# Altium schematic sheet TPS65218.SchDoc
size A2
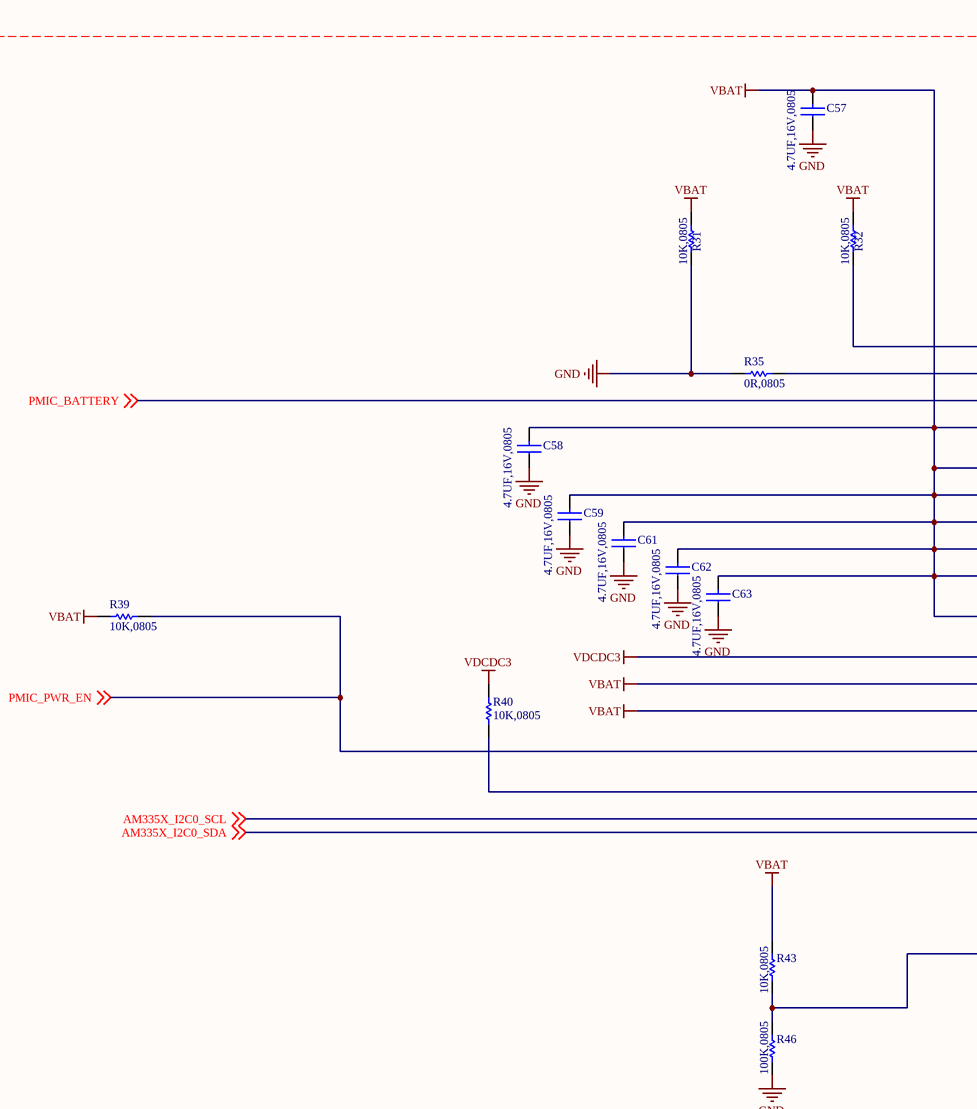
[diagram p0: TPS65218.SchDoc, top left]
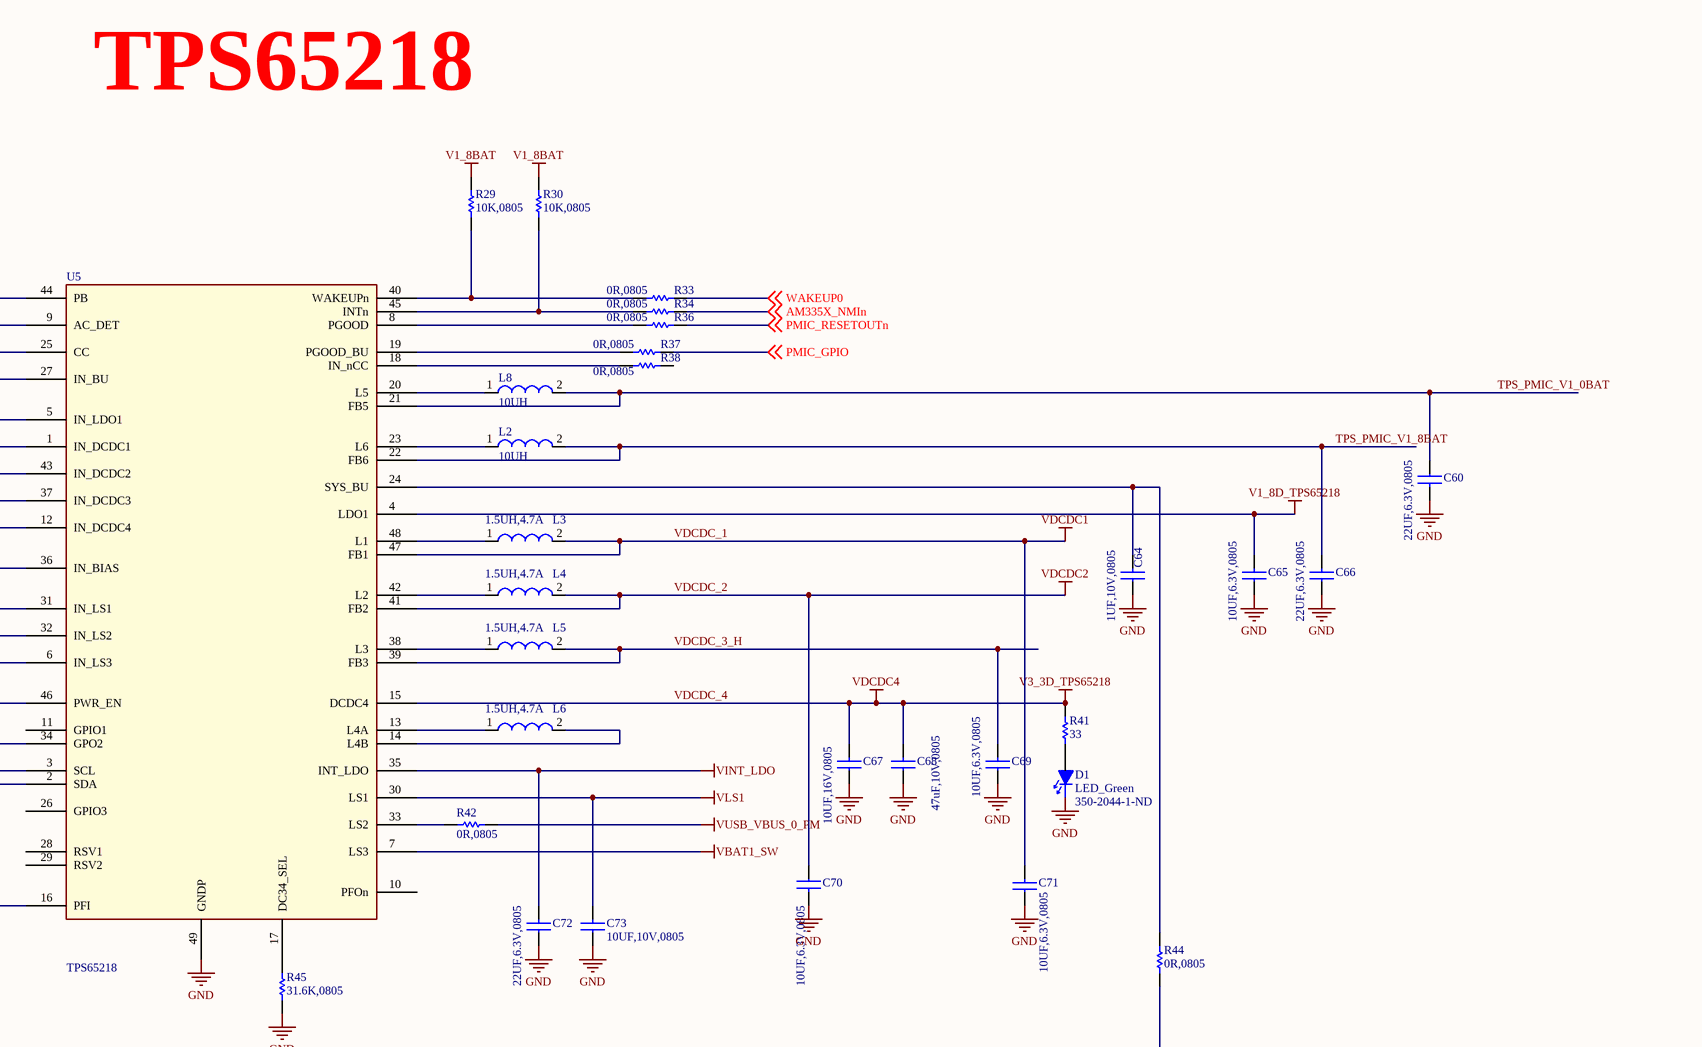
[diagram p1: TPS65218.SchDoc, top right]
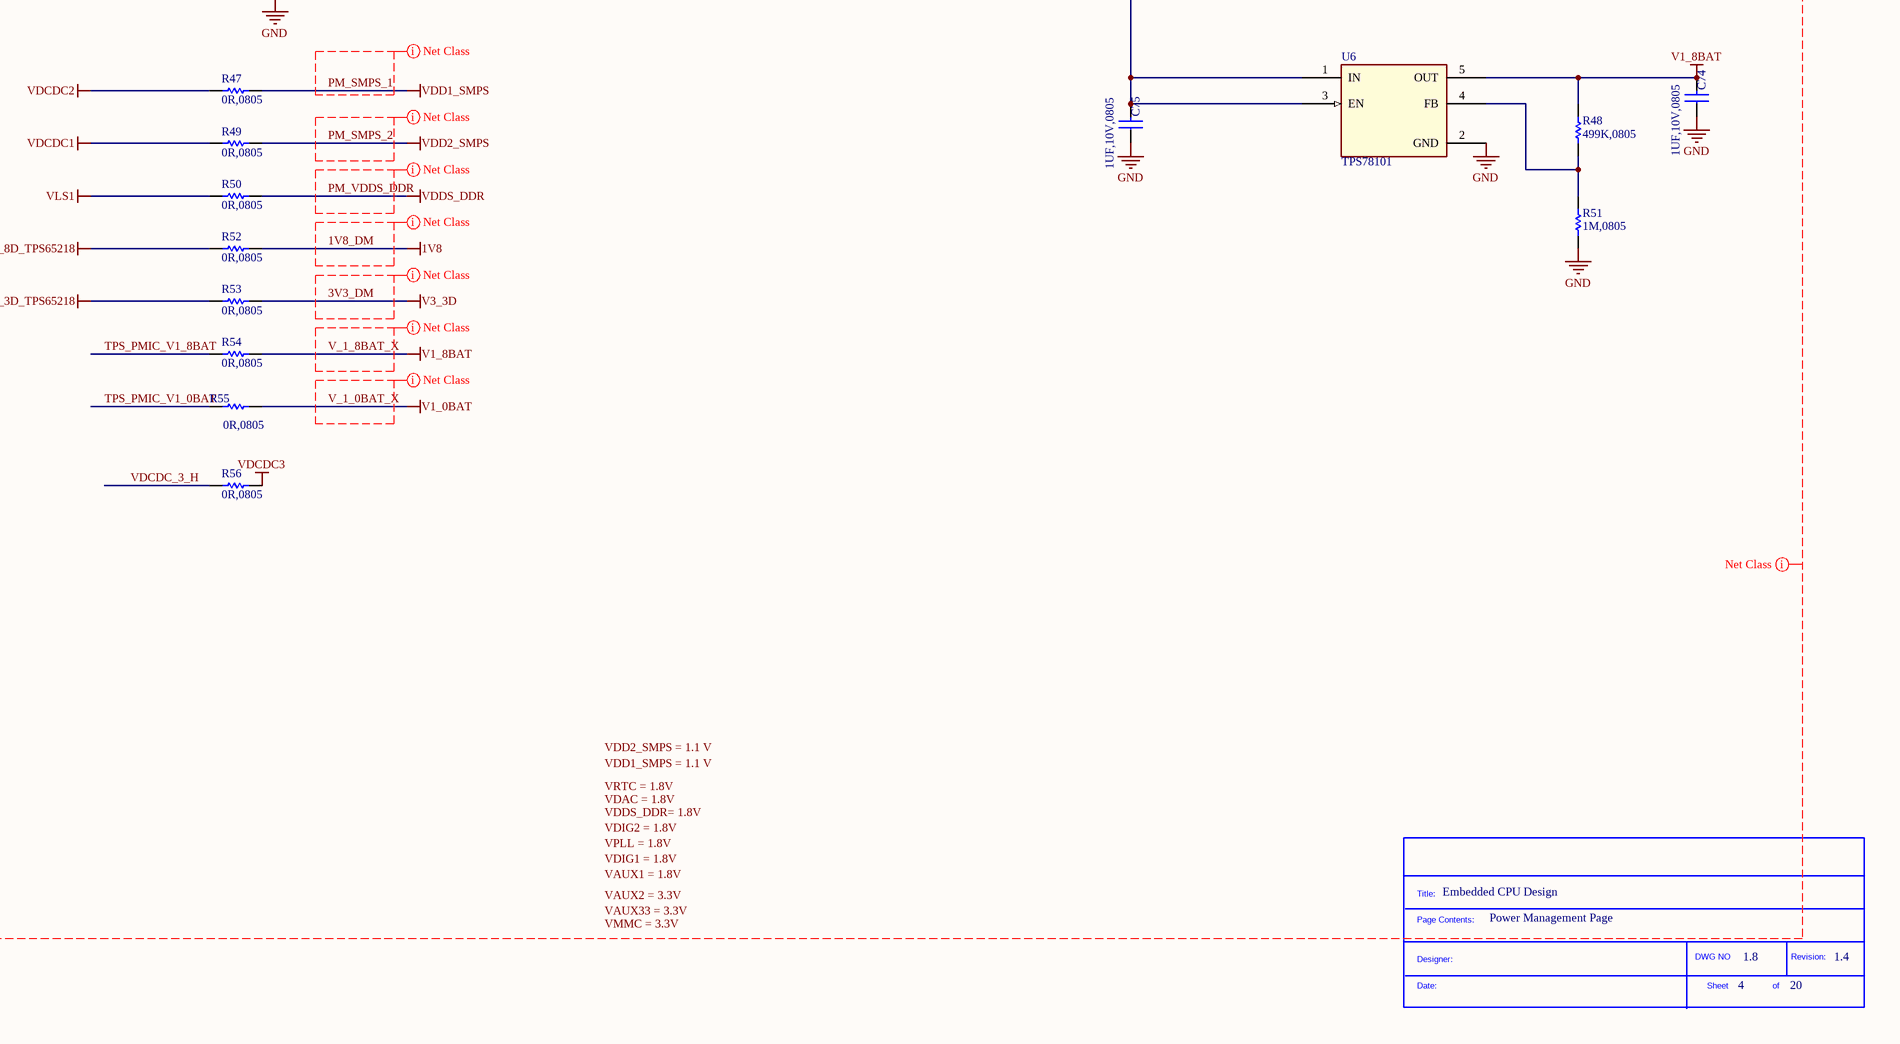
[diagram p2: TPS65218.SchDoc, bottom right]

## Parts
*?  SDTitleBlock  (value not drawn)  (graphical)
C57  4.7UF,16V,0805  [0805]
C58  4.7UF,16V,0805  [0805]
C59  4.7UF,16V,0805  [0805]
C60  22UF,6.3V,0805  [0805]
C61  4.7UF,16V,0805  [0805]
C62  4.7UF,16V,0805  [0805]
C63  4.7UF,16V,0805  [0805]
C64  1UF,10V,0805  [0805]
C65  10UF,6.3V,0805  [0805]
C66  22UF,6.3V,0805  [0805]
C67  10UF,16V,0805  [0805]
C68  47uF,10V,0805  [0805]
C69  10UF,6.3V,0805  [0805]
C70  10UF,6.3V,0805  [0805]
C71  10UF,6.3V,0805  [0805]
C72  22UF,6.3V,0805  [0805]
C73  10UF,10V,0805  [0805]
C74  1UF,10V,0805  [0805]
C75  1UF,10V,0805  [0805]
D1  LED_Green  Supplier Part Number 1: 350-2044-1-ND  [LED_0805]
L2  10UH  [0805]
L3  1.5UH,4.7A  [INDUCTR_2]
L4  1.5UH,4.7A  [INDUCTR_2]
L5  1.5UH,4.7A  [INDUCTR_2]
L6  1.5UH,4.7A  [INDUCTR_2]
L8  10UH  [0805]
R29  10K,0805  [0402]
R30  10K,0805  [0402]
R31  10K,0805  [0402]
R32  10K,0805  [0402]
R33  0R,0805  [0402]
R34  0R,0805  [0402]
R35  0R,0805  [0402]
R36  0R,0805  [0402]
R37  0R,0805  [0402]
R38  0R,0805  [0402]
R39  10K,0805  [0402]
R40  10K,0805  [0402]
R41  33  [0402]
R42  0R,0805  [0402]
R43  10K,0805  [0402]
R44  0R,0805  [0402]
R45  31.6K,0805  [0603]
R46  100K,0805  [0402]
R47  0R,0805  [0402]
R48  499K,0805  [0402]
R49  0R,0805  [0402]
R50  0R,0805  [0402]
R51  1M,0805  [0402]
R52  0R,0805  [0402]
R53  0R,0805  [0402]
R54  0R,0805  [0402]
R55  0R,0805  [0402]
R56  0R,0805  [0402]
U5  TPS65218  [HTQFP_48pin]
U6  TPS78101  [smdsc70-5 DOUBLE]

## Nets
1V8_DM: R52.2  [also labelled 1V8]
3V3_DM: R53.1  [also labelled V3_3D]
GND: C57.1 C58.1 C59.1 C60.2 C61.1 C62.1 C63.1 C64.1 C65.1 C66.1 C67.1 C68.1 C69.1 C70.2 C71.1 C72.1 C73.1 C74.1 C75.1 D1.1(Cathode) R31.1 R35.1 R45.1 R46.1 R51.1 U5.49(GNDP) U6.2(GND)
PM_SMPS_1: R47.2  [also labelled VDD1_SMPS]
PM_SMPS_2: R49.2  [also labelled VDD2_SMPS]
PM_VDDS_DDR: R50.2  [also labelled VDDS_DDR]
V1_8D_TPS65218: C65.2 R52.1 U5.4(LDO1)
V_1_0BAT_X: R55.2  [also labelled V1_0BAT]
V_1_8BAT_X: C74.2 R29.2 R30.2 R48.2 R54.2 U6.5(OUT)  [also labelled V1_8BAT]
VBAT: C57.2 C58.2 C59.2 C61.2 C62.2 C63.2 R31.2 R32.2 R39.1 R43.2 U5.1(IN_DCDC1) U5.5(IN_LDO1) U5.6(IN_LS3) U5.12(IN_DCDC4) U5.27(IN_BU) U5.32(IN_LS2) U5.36(IN_BIAS) U5.37(IN_DCDC3) U5.43(IN_DCDC2)
VBAT1_SW: U5.7(LS3)
VDCDC3: R40.2 R56.2 U5.31(IN_LS1)
VDCDC_1: C71.2 L3.2 R49.1 U5.47(FB1)  [also labelled VDCDC1]
VDCDC_2: C70.1 L4.2 R47.1 U5.41(FB2)  [also labelled VDCDC2]
VDCDC_4: C67.2 C68.2 R41.2 R53.2 U5.15(DCDC4)  [also labelled V3_3D_TPS65218, VDCDC4]
VINT_LDO: C72.2 U5.35(INT_LDO)
VLS1: C73.2 R50.1 U5.30(LS1)
VUSB_VBUS_0_PM: R42.2
AM335X_I2C0_SCL: U5.3(SCL) ; off-sheet AM335X_I2C0_SCL
AM335X_I2C0_SDA: U5.2(SDA) ; off-sheet AM335X_I2C0_SDA
AM335X_NMIn: R34.2 ; off-sheet AM335X_NMIn
PMIC_BATTERY: U5.25(CC) ; off-sheet PMIC_BATTERY
PMIC_GPIO: R37.2 ; off-sheet PMIC_GPIO
PMIC_PWR_EN: R39.2 U5.46(PWR_EN) ; off-sheet PMIC_PWR_EN
PMIC_RESETOUTn: R36.2 ; off-sheet PMIC_RESETOUTn
TPS_PMIC_V1_0BAT: C60.1 L8.2 R55.1 U5.21(FB5)
TPS_PMIC_V1_8BAT: C66.2 L2.2 R54.1 U5.22(FB6)
VDCDC_3_H: C69.2 L5.2 R56.1 U5.39(FB3)
WAKEUP0: R33.2 ; off-sheet WAKEUP0
NetC64_2: C64.2 R44.2 U5.24(SYS_BU)
NetC75_2: C75.2 R44.1 U6.1(IN) U6.3(EN)
NetD1_2: D1.2(Anode) R41.1
NetL2_1: L2.1 U5.23(L6)
NetL3_1: L3.1 U5.48(L1)
NetL4_1: L4.1 U5.42(L2)
NetL5_1: L5.1 U5.38(L3)
NetL6_1: L6.1 U5.13(L4A)
NetL6_2: L6.2 U5.14(L4B)
NetL8_1: L8.1 U5.20(L5)
NetR29_1: R29.1 R33.1 U5.40(WAKEUPn)
NetR30_1: R30.1 R34.1 U5.45(INTn)
NetR32_1: R32.1 U5.44(PB)
NetR35_2: R35.2 U5.9(AC_DET)
NetR36_1: R36.1 U5.8(PGOOD)
NetR37_1: R37.1 U5.19(PGOOD_BU)
NetR38_1: R38.1 U5.18(IN_nCC)
NetR40_1: R40.1 U5.34(GPO2)
NetR42_1: R42.1 U5.33(LS2)
NetR43_1: R43.1 R46.2 U5.16(PFI)
NetR45_2: R45.2 U5.17(DC34_SEL)
NetR48_1: R48.1 R51.2 U6.4(FB)

Not connected (* = marked no-connect by the designer): R38 2; U5 10(PFOn) 11(GPIO1) 26(GPIO3) 28(RSV1) 29(RSV2)

## Layout directives
net class PM_SMPS_2: PM_SMPS_2
net class PM_SMPS_1: PM_SMPS_1
net class PM_VDDS_DDR: PM_VDDS_DDR
net class PM_VDIG2: 1V8_DM
net class PM_3V3DM: 3V3_DM
net class TPS65218: 1V8, 1V8_DM, 3V3_DM, AM335X_I2C0_SCL, AM335X_I2C0_SDA, AM335X_NMIn, GND, PM_SMPS_1, PM_SMPS_2, PM_VDDS_DDR, PMIC_BATTERY, PMIC_GPIO, PMIC_PWR_EN, PMIC_RESETOUTn, TPS_PMIC_V1_0BAT, TPS_PMIC_V1_8BAT, V1_0BAT, V1_8BAT, V1_8D_TPS65218, V3_3D, V3_3D_TPS65218, V_1_0BAT_X, V_1_8BAT_X, VAUX1 = 1.8V, VAUX2 = 3.3V, VAUX33 = 3.3V, VBAT, VBAT1_SW, VDAC = 1.8V, VDCDC1, VDCDC2, VDCDC3, VDCDC4, VDCDC_1, VDCDC_2, VDCDC_3_H, VDCDC_4, VDD1_SMPS, VDD1_SMPS = 1.1 V, VDD2_SMPS, VDD2_SMPS = 1.1 V, VDDS_DDR, VDDS_DDR= 1.8V, VDIG1 = 1.8V, VDIG2 = 1.8V, VINT_LDO, VLS1, VMMC = 3.3V, VPLL = 1.8V, VRTC = 1.8V, VUSB_VBUS_0_PM, WAKEUP0
net class PM_V_1_8BAT_X: V_1_8BAT_X
net class PM_V_1_0BAT_X: V_1_0BAT_X

## Notes on the sheet
- TPS65218
- Embedded CPU Design
- Power Management Page
- 1.8
- 1.4
- 4
- 20
- Labels drawn without touching a wire or pin: VAUX1 = 1.8V, VAUX2 = 3.3V, VAUX33 = 3.3V, VDAC = 1.8V, VDD1_SMPS = 1.1 V, VDD2_SMPS = 1.1 V, VDDS_DDR= 1.8V, VDIG1 = 1.8V, VDIG2 = 1.8V, VMMC = 3.3V, VPLL = 1.8V, VRTC = 1.8V
- (in symbol SDTitleBlock) Title:; Page Contents:; Designer:; DWG NO; Revision:; Date:; Sheet; of

## Library data of the parts
C57-C59 C61-C63 = 4.7UF,16V,0805: AVX - 0805YC475KAT2A - CAP, MLCC, X7R, 4.7UF, 16V, 0805; Capacitance: 4.7; Capacitance Tolerance: ± 10%; Dielectric Characteristic: X7; Voltage Rating: 16; Ceramic Capacitor Case: 0805 [2012 Metric]; SVHC: No SVHC (16-Jun-2014); Capacitor Terminals: SMD; Tolerance: ±10%; Temperature Coefficient: X5R; Manufacturer: AVX; Manufacturer Part Number: 0805YC475KAT2A; RoHS: YES; Product Range: -; Operating Temperature Min: -55; Operating Temperature Max: 125; Packaging: Cut Tape; MSL: MSL 1 - Unlimited; Capacitance Tolerance ±: ± 10%; Capacitor Case Style: 0805 [2012 Metric]; Operating Temperature Range: -55°C to +125; Series: MLCC<!--FANDB--><div class="features-and-benefits-container"></div>; ComponentLink1URL: http://www.farnell.com/datasheets/1679506.pdf; ComponentLink1Description: http://www.farnell.com/datasheets/1679506.pdf; ComponentLink2URL: http://www.farnell.com/cad/1614401.zip; ComponentLink2Description: http://www.farnell.com/cad/1614401.zip; Supplier 1: Digi-Key; Category: Capacitors; Stock 1: 362746; Pricing 1: 1=0.21, 10=0.146, 25=0.1064, 100=0.0743, 500=0.0531, 1000=0.04514 (USD); Voltage - Rated: 16V; Mounting Type: Surface Mount, MLCC; Operating Temperature: -55°C ~ 85°C; Applications: General Purpose; Ratings: -; Package / Case: 0805 (2012 Metric); Size / Dimension: 0.079" L x 0.049" W (2.00mm x 1.25mm); Height - Seated (Max): -; Thickness (Max): 0.053" (1.35mm); Lead Spacing: -; Features: -; Lead Style: -; ComponentLink3URL: http://www.samsungsem.com/kr/front/downloadcms.do?path=/kr/support/product-search/mlcc/__icsFiles/afieldfile/2014/11/05&fileName=S_CL21A475KOFNNNE.pdf; ComponentLink3Description: http://www.samsungsem.com/kr/front/downloadcms.do?path=/kr/support/product-search/mlcc/__icsFiles/afieldfile/2014/11/05&fileName=S_CL21A475KOFNNNE.pdf; Supplier Part Number 1: 1276-1065-1-ND
C60 C66 C72 = 22UF,6.3V,0805: CAP CER 22UF 6.3V 10% X5R 0805; Manufacturer: Samsung Electro-Mechanics America, Inc; Manufacturer Part Number: CL21A226KQQNNNE; Capacitance: 22µF; Supplier 1: Digi-Key; RoHS: RoHS Compliant; Category: Capacitors; Stock 1: 218754; Pricing 1: 1=0.27, 10=0.182, 25=0.132, 50=0.11, 100=0.0924, 250=0.0748, 500=0.066, 1000=0.0561 (USD); Packaging: Digi-Reel®; Tolerance: ±10%; Voltage - Rated: 6.3V; Temperature Coefficient: X5R; Mounting Type: Surface Mount, MLCC; Operating Temperature: -55°C ~ 85°C; Applications: General Purpose; Ratings: -; Package / Case: 0805 (2012 Metric); Size / Dimension: 0.079" L x 0.049" W (2.00mm x 1.25mm); Height - Seated (Max): -; Thickness (Max): 0.055" (1.40mm); Lead Spacing: -; Features: -; Lead Style: -; ComponentLink1URL: http://www.samsungsem.com/servlet/FileDownload?type=spec&file=CL21A226KQQNNNE.pdf; ComponentLink1Description: http://www.samsungsem.com/servlet/FileDownload?type=spec&file=CL21A226KQQNNNE.pdf; Supplier Part Number 1: 1276-2907-6-ND
C64 C74 C75 = 1UF,10V,0805: AVX - 0805ZC105JAT2A - CAP, MLCC, X7R, 1UF, 10V, 0805; Capacitance: 1; Capacitance Tolerance: ± 5%; Dielectric Characteristic: X7; Voltage Rating: 10; Ceramic Capacitor Case: 0805 [2012 Metric]; SVHC: No SVHC (16-Jun-2014); Capacitor Case Style: 0805 [2012 Metric]<!--FANDB--><div class="features-and-benefits-container"></div>; Tolerance: ±5%; Manufacturer: AVX; Manufacturer Part Number: 0805ZC105JAT2A; RoHS: YES; Product Range: -; Operating Temperature Min: -55; Operating Temperature Max: 125; Packaging: Cut Tape; MSL: MSL 1 - Unlimited; Capacitance Tolerance ±: ± 5%; ComponentLink1URL: http://www.farnell.com/datasheets/1679506.pdf; ComponentLink1Description: http://www.farnell.com/datasheets/1679506.pdf; Supplier 1: Digi-Key; Category: Capacitors; Stock 1: 13938; Pricing 1: 1=0.81, 10=0.689, 100=0.403, 250=0.338, 500=0.3055, 1000=0.2795 (USD); Voltage - Rated: 10V; Temperature Coefficient: X7R; Mounting Type: Surface Mount, MLCC; Operating Temperature: -55°C ~ 125°C; Applications: General Purpose; Ratings: -; Package / Case: 0805 (2012 Metric); Size / Dimension: 0.079" L x 0.049" W (2.01mm x 1.25mm); Height - Seated (Max): -; Thickness (Max): 0.055" (1.40mm); Lead Spacing: -; Features: -; Lead Style: -; ComponentLink2URL: http://www.avx.com/docs/Catalogs/cx7r.pdf; ComponentLink2Description: http://www.avx.com/docs/Catalogs/cx7r.pdf; Supplier Part Number 1: 478-6224-1-ND
C65 C69-C71 = 10UF,6.3V,0805: Multilayer Ceramic Capacitors MLCC - SMD/SMT 10UF    6.3V   10%        0805; Manufacturer: TDK; Manufacturer Part Number: C2012X7R0J106K125AB; Type: Commercial Grade MLCC; Case Height: 1.25 mm; Case Length: 2 mm; Class: Class 2; Dielectric: X7R; Dissipation Factor DF: 10; Temperature Coefficient / Code: +/- 15 %; Product Status: New Product; Supplier 1: Mouser; RoHS: RoHS Compliant; Category: Multilayer Ceramic Capacitors MLCC - SMD/SMT; Stock 1: 3732; Pricing 1: 1=0.609, 10=0.530, 100=0.195, 1000=0.171, 2000=0.126, 10000=0.116, 24000=0.111, 50000=0.104, 100000=0.097 (AUD); Capacitance: 10 uF; Operating Temperature Range: - 55 C to + 125 C; Package / Case: 0805 (2012 metric); Packaging: Reel; Product: General Type MLCCs; Termination Style: SMD/SMT; Tolerance: 10 %; Voltage Rating DC: 6.3 V; Brand: TDK; Case Code - in: 0805; Case Code - mm: 2012; Case Width: 1.25 mm; Maximum Operating Temperature: + 125 C; Minimum Operating Temperature: - 55 C; RoHS - Mouser: Y; Minimum Order Quantity: 1; Reeling: True; ComponentLink1URL: http://www.mouser.com/ds/2/400/mlcc_commercial_general_en-266370.pdf; ComponentLink1Description: http://www.mouser.com/ds/2/400/mlcc_commercial_general_en-266370.pdf; Supplier Part Number 1: 810-C2012X7R0J106KAB
C67 = 10UF,16V,0805: AVX - 0805YD106KAT2A - CAP, MLCC, X5R, 10UF, 16V, 0805; Capacitance: 10; Capacitance Tolerance: ± 10%; Dielectric Characteristic: X5; Voltage Rating: 16; Ceramic Capacitor Case: 0805 [2012 Metric]; SVHC: No SVHC (16-Jun-2014); Capacitor Terminals: SMD; Tolerance: ±10%; Manufacturer: AVX; Manufacturer Part Number: 0805YD106KAT2A; RoHS: YES; Product Range: -; Operating Temperature Min: -55; Operating Temperature Max: 85; Packaging: Cut Tape; MSL: MSL 1 - Unlimited; Capacitance Tolerance ±: ± 10%; Capacitor Case Style: 0805 [2012 Metric]; Operating Temperature Range: -55°C to +85; Series: MLCC<!--FANDB--><div class="features-and-benefits-container"></div>; ComponentLink1URL: http://www.farnell.com/datasheets/1666675.pdf; ComponentLink1Description: http://www.farnell.com/datasheets/1666675.pdf; ComponentLink2URL: http://www.farnell.com/cad/1614404.zip; ComponentLink2Description: http://www.farnell.com/cad/1614404.zip; Supplier 1: Digi-Key; Category: Capacitors; Stock 1: 779135; Pricing 1: 1=0.25, 10=0.171, 25=0.1244, 100=0.0872, 500=0.06226, 1000=0.05291 (USD); Voltage - Rated: 16V; Temperature Coefficient: X5R; Mounting Type: Surface Mount, MLCC; Operating Temperature: -55°C ~ 85°C; Applications: General Purpose; Ratings: -; Package / Case: 0805 (2012 Metric); Size / Dimension: 0.079" L x 0.049" W (2.00mm x 1.25mm); Height - Seated (Max): -; Thickness (Max): 0.055" (1.40mm); Lead Spacing: -; Features: -; Lead Style: -; ComponentLink3URL: http://www.samsungsem.com/kr/front/downloadcms.do?path=/kr/support/product-search/mlcc/__icsFiles/afieldfile/2014/11/05&fileName=S_CL21A106KOQNNNE.pdf; ComponentLink3Description: http://www.samsungsem.com/kr/front/downloadcms.do?path=/kr/support/product-search/mlcc/__icsFiles/afieldfile/2014/11/05&fileName=S_CL21A106KOQNNNE.pdf; Supplier Part Number 1: 1276-1096-1-ND
C68 = 47uF,10V,0805: Multilayer Ceramic Capacitors MLCC - SMD/SMT 0805 47uF 10volts X5R +/-20%; Manufacturer: TDK; Manufacturer Part Number: C2012X5R1A476M125AC; Tolerance: 20 %; Type: Multilayer Ceramic Chip Capacitor; Case Height: 1.25 mm; Case Length: 2 mm; Temperature Coefficient / Code: +/- 15 %; Supplier 1: Mouser; RoHS: RoHS Compliant; Category: Multilayer Ceramic Capacitors MLCC - SMD/SMT; Stock 1: 127308; Pricing 1: 1=1.53, 10=1.28, 100=0.615, 1000=0.548, 2000=0.368, 10000=0.349, 24000=0.342, 50000=0.337 (AUD); Capacitance: 47 uF; Package / Case: 0805 (2012 metric); Packaging: Reel; Product: General Type MLCCs; Termination Style: SMD/SMT; Voltage Rating DC: 10 V; Brand: TDK; Case Code - in: 0805; Case Code - mm: 2012; Case Width: 1.25 mm; Dielectric: X5R; Maximum Operating Temperature: + 85 C; Minimum Operating Temperature: - 55 C; Standard Pack Qty: 2000; RoHS - Mouser: Y; Minimum Order Quantity: 1; Reeling: True; ComponentLink1URL: http://www.mouser.com/ds/2/400/mlcc_commercial_general_en-266370.pdf; ComponentLink1Description: http://www.mouser.com/ds/2/400/mlcc_commercial_general_en-266370.pdf; Supplier Part Number 1: 810-C2012X5R1A476M
C73 = 10UF,10V,0805: Multilayer Ceramic Capacitors MLCC - SMD/SMT 10uF 10% 10Volts; Manufacturer: TDK; Manufacturer Part Number: C2012X7R1A106K125AC; Type: Multilayer Ceramic Chip Capacitor; Case Height: 1.25 mm; Case Length: 2 mm; Dielectric: X7R; Temperature Coefficient / Code: +/- 15 %; Supplier 1: Mouser; RoHS: RoHS Compliant; Category: Multilayer Ceramic Capacitors MLCC - SMD/SMT; Stock 1: 114858; Pricing 1: 1=0.609, 10=0.530, 100=0.195, 1000=0.171, 2000=0.126, 10000=0.116, 24000=0.111, 50000=0.104, 100000=0.097 (AUD); Capacitance: 10 uF; Operating Temperature Range: - 55 C to + 125 C; Package / Case: 0805 (2012 metric); Packaging: Reel; Product: General Type MLCCs; Termination Style: SMD/SMT; Tolerance: 10 %; Voltage Rating DC: 10 V; Brand: TDK; Case Code - in: 0805; Case Code - mm: 2012; Case Width: 1.25 mm; Maximum Operating Temperature: + 125 C; Minimum Operating Temperature: - 55 C; Standard Pack Qty: 2000; RoHS - Mouser: Y; Minimum Order Quantity: 1; Reeling: True; ComponentLink1URL: http://www.mouser.com/ds/2/400/mlcc_commercial_general_en-266370.pdf; ComponentLink1Description: http://www.mouser.com/ds/2/400/mlcc_commercial_general_en-266370.pdf; Supplier Part Number 1: 810-C2012X7R1A106K
D1 = LED_Green: LED Green SMD 20mA 2V 0805; TIIntPartnumber: 1F0008; MfrNum: 598-8170-107F; Mfr: Dialight; PartName: LEDGreen2x1.5; Cost10K: 0.052; Cost100: 0.081; Vendor: Digikey; Wavelength - Dominant: 566nm; Millicandela Rating: 20mcd; Viewing Angle: 140°; Lens Type: Clear; Lens Style/Size: Rectangle with Flat Top, 1.4mm x 1.25mm; DescriptiveText: LED Green SMD 20mA 2V 0805; Descriptive_Text: LED Green SMD 20mA 2V 0805; Supplier 1: Digi-Key; Manufacturer: Dialight; Manufacturer Part Number: 598-8170-107F; RoHS: RoHS Compliant; Category: Optoelectronics; Stock 1: 91030; Pricing 1: 1=0.42, 10=0.31, 25=0.248, 100=0.1643, 250=0.1364, 500=0.0992, 1000=0.0775 (USD); Packaging: Cut Tape (CT); Color: Green; Wavelength - Peak: -; Voltage - Forward (Vf) (Typ): 2V; Current - Test: 20mA; Package / Case: 0805 (2012 Metric); Size / Dimension: 2.00mm L x 1.25mm W; Height: 0.70mm; Mounting Type: Surface Mount; Luminous Flux @ Current - Test: -; ComponentLink1URL: http://media.digikey.com/pdf/Data%20Sheets/Dialight%20PDFs/598_Series_0805_Pkg.pdf; ComponentLink1Description: http://media.digikey.com/pdf/Data%20Sheets/Dialight%20PDFs/598_Series_0805_Pkg.pdf
L2 L8 = 10UH: FIXED IND 10UH 500MA 390 MOHM; Manufacturer: TDK Corporation; Manufacturer Part Number: MLZ2012N100LTD25; Type: Multilayer; Material - Core: Ferrite; Inductance: 10µH; Tolerance: ±20%; Current - Saturation: 110mA; Shielding: Shielded; DC Resistance (DCR): 390 mOhm Max; Frequency - Test: 2MHz; Supplier 1: Digi-Key; RoHS: RoHS Compliant; Category: Inductors, Coils, Chokes; Stock 1: 7996; Pricing 1: 1=0.18, 10=0.163, 50=0.1268, 100=0.1138, 500=0.0975, 1000=0.0845 (USD); Packaging: Cut Tape (CT); Current Rating: 500mA; Q @ Freq: -; Frequency - Self Resonant: -; Operating Temperature: -55°C ~ 125°C; Mounting Type: Surface Mount; Package / Case: 0805 (2012 Metric); Size / Dimension: 0.079" L x 0.049" W (2.00mm x 1.25mm); Height - Seated (Max): 0.041" (1.05mm); Supplier Device Package: 0805 (2012 Metric); ComponentLink1URL: http://product.tdk.com/inductor/ind/en/documents/inductor_automotive_decoupling_mlz_en.pdf; ComponentLink1Description: http://product.tdk.com/inductor/ind/en/documents/inductor_automotive_decoupling_mlz_en.pdf; Supplier Part Number 1: 445-16376-1-ND
L3-L6 = 1.5UH,4.7A: Fixed Inductors 1.5uH 4.7A 90mOhms Power Circuits; Manufacturer: TDK; Manufacturer Part Number: SPM3012T-1R5M-CA; Core Material: Metal; Maximum DC Resistance: 0.09 Ohms; Shielding: Unshielded; Tolerance: 20 %; Type: SMD Power Inductor; Case Height: 1.2 mm; Case Length: 3.2 mm; Case Width: 3 mm; Test Frequency: 100 kHz; Product Status: New Product; Supplier 1: Mouser; RoHS: RoHS Compliant; Category: Fixed Inductors; Stock 1: 0; Pricing 1: 1=2.84, 10=2.15, 100=1.66, 500=1.21, 1000=1.17, 2000=1.11, 4000=1.08, 10000=1.04 (AUD); Inductance: 1.5 uH; Maximum DC Current: 4.7 A; Operating Temperature Range: - 40 C to + 125 C; Packaging: Reel; Product: Power Inductors; Series: SPM-CA; Termination Style: SMD/SMT; Brand: TDK; RoHS - Mouser: Y; Minimum Order Quantity: 1; Reeling: True; ComponentLink1URL: http://www.mouser.com/ds/2/400/SPM3012-CA data sheet(12a)-516280.pdf; ComponentLink1Description: http://www.mouser.com/ds/2/400/SPM3012-CA data sheet(12a)-516280.pdf; Supplier Part Number 1: 810-SPM3012T-1R5M-CA
R29-R32 R39 R40 R43 = 10K,0805: BOURNS - CR0805-FX-1002GLF - RESISTOR, 10K, 0.125W, 1%; Product Range: BOURNS - CR Series; Resistance: 10; Power Rating: 125; Resistor Case Style: 0805 [2012 Metric]; Resistor Element Material: Thick Film; Temperature Coefficient: ± 100; Voltage Rating: 150; SVHC: No SVHC (16-Jun-2014); Resistor Mounting: SMD<!--FANDB--><div class="features-and-benefits-container"></div>; Power (Watts): 0.125W, 1/8W; Manufacturer: BOURNS; Manufacturer Part Number: CR0805-FX-1002GLF; RoHS: YES; Resistance Tolerance: ± 1%; Packaging: Cut Tape; MSL: MSL 1 - Unlimited; ComponentLink1URL: http://www.farnell.com/datasheets/1845293.pdf; ComponentLink1Description: http://www.farnell.com/datasheets/1845293.pdf; Supplier 1: Digi-Key; Category: Resistors; Stock 1: 1116166; Pricing 1: 1=0.1, 10=0.029, 50=0.0162, 100=0.0123, 250=0.00912, 500=0.00672, 1000=0.00448, 2500=0.00378 (USD); Resistance (Ohms): 10k; Tolerance: ±1%; Composition: Thick Film; Features: -; Operating Temperature: -55°C ~ 155°C; Package / Case: 0805 (2012 Metric); Supplier Device Package: 0805; Size / Dimension: 0.079" L x 0.049" W (2.00mm x 1.25mm); Height: 0.026" (0.65mm); Number of Terminations: 2; ComponentLink2URL: http://www.seielect.com/Catalog/SEI-RMCF_RMCP.pdf; ComponentLink2Description: http://www.seielect.com/Catalog/SEI-RMCF_RMCP.pdf; Supplier Part Number 1: RMCF0805FT10K0CT-ND
R33-R38 R42 R44 R47 R49 R50 R52-R56 = 0R,0805: BOURNS - CR0805-J/-000ELF - RESISTOR, 0805, 0R, 5%, 1/8W; Product Range: BOURNS - CR Series; Resistance: 0; Power Rating: 125; Resistor Case Style: 0805 [2012 Metric]; Resistor Element Material: Thick Film; Temperature Coefficient: -250ppm/°C to +500; Voltage Rating: 150; SVHC: No SVHC (16-Jun-2014); Resistor Mounting: SMD<!--FANDB--><div class="features-and-benefits-container"></div>; Connector Type: RJ45; Number of Ports: 1; LED Color: Green - Yellow; Number of Cores per Jack: 6; Shielding: Shielded, EMI Finger; Tab Direction: Up; Shield Material: Brass; Resistance (Ohms): 0.0; Tolerance: Jumper; Power (Watts): 0.125W, 1/8W; Manufacturer: BOURNS; Manufacturer Part Number: CR0805-J/-000ELF; RoHS: YES; Resistance Tolerance: ± 5%; Packaging: Cut Tape; MSL: MSL 1 - Unlimited; ComponentLink1URL: http://www.farnell.com/datasheets/1845293.pdf; ComponentLink1Description: http://www.farnell.com/datasheets/1845293.pdf; Category: Connectors, Interconnects; Number of Rows: 1; Applications: 10/100 Base-T, AutoMDIX; Mounting Type: Through Hole; Orientation: 90° Angle (Right); Termination: Solder; Height Above Board: 0.555" (14.10mm); Features: Board Lock, Decoupling Capacitance; Contact Material: Phosphor Bronze; Contact Finish: Gold; Contact Finish Thickness: 50µin (1.27µm); Housing Material: Polyethylene Terephthalate (PET), Polyester; Operating Temperature: 0°C ~ 70°C; ComponentLink2URL: http://www.trpconnector.com/pdfs/6605728.pdf; ComponentLink2Description: http://www.trpconnector.com/pdfs/6605728.pdf; Supplier 1: Digi-Key; Stock 1: 1539206; Pricing 1: 1=0.1, 50=0.0196, 100=0.0149, 250=0.01104, 500=0.00816, 1000=0.00544, 2500=0.00459 (USD); Composition: Thick Film; Package / Case: 0805 (2012 Metric); Supplier Device Package: 0805; Size / Dimension: 0.079" L x 0.049" W (2.00mm x 1.25mm); Height: 0.028" (0.70mm); Number of Terminations: 2; ComponentLink3URL: http://industrial.panasonic.com/www-cgi/jvcr13pz.cgi?E+PZ+3+AOA0001+ERJ6GEY0R00V+7+WW; ComponentLink3Description: http://industrial.panasonic.com/www-cgi/jvcr13pz.cgi?E+PZ+3+AOA0001+ERJ6GEY0R00V+7+WW; Supplier Part Number 1: P0.0ACT-ND
R41 = 33: MULTICOMP - MC0805S8F330JT5E - RESISTOR, THICK FILM, 33 OHM, 125mW, 1%; Power (Watts): 0.1W, 1/10W; Temperature Coefficient: ±100ppm/°C; Manufacturer: MULTICOMP; Manufacturer Part Number: MC0805S8F330JT5E; RoHS: YES; ComponentLink1URL: http://www.newark.com/pdfs/datasheets/spc/TA-677.pdf; ComponentLink1Description: http://www.newark.com/pdfs/datasheets/spc/TA-677.pdf; Supplier 1: Digi-Key; Category: Resistors; Stock 1: 1096583; Pricing 1: 1=0.1, 50=0.0196, 100=0.0149, 250=0.01104, 500=0.00816, 1000=0.00544, 5000=0.00383 (USD); Packaging: Cut Tape (CT); Resistance (Ohms): 33; Tolerance: ±1%; Composition: Thick Film; Features: Automotive AEC-Q200; Operating Temperature: -55°C ~ 155°C; Package / Case: 0402 (1005 Metric); Supplier Device Package: 0402; Size / Dimension: 0.039" L x 0.020" W (1.00mm x 0.50mm); Height: 0.016" (0.40mm); Number of Terminations: 2; ComponentLink2URL: http://industrial.panasonic.com/www-cgi/jvcr13pz.cgi?E+PZ+3+AOA0002+ERJ2RKF33R0X+7+WW; ComponentLink2Description: http://industrial.panasonic.com/www-cgi/jvcr13pz.cgi?E+PZ+3+AOA0002+ERJ2RKF33R0X+7+WW; Supplier Part Number 1: P33.0LCT-ND
R45 = 31.6K,0805: Thick Film Resistors - SMD 1/8watt 31.6Kohms 1% 100ppm; Manufacturer: Vishay / Dale; Manufacturer Part Number: CRCW080531K6FKEA; Power Rating: 125 mW (1/8 W); Temperature Coefficient: 100 PPM / K; Voltage Rating: 150 V; Case Height: 0.45 mm; Case Length: 2 mm; Case Width: 1.25 mm; Supplier 1: Mouser; RoHS: RoHS Compliant By Exemption; Category: Thick Film Resistors - SMD; Stock 1: 19189; Pricing 1: 1=0.119, 10=0.071, 100=0.040, 1000=0.027, 5000=0.007, 100000=0.006 (AUD); Operating Temperature Range: - 55 C to + 155 C; Package / Case: 0805 (2012 metric); Packaging: Reel; Product: Thick Film Resistors SMD; Resistance: 31.6 kOhms; Series: CRCW; Tolerance: 1 %; Brand: Vishay / Dale; Case Code - in: 0805; Case Code - mm: 2012; Product Category: 0805 Thick Film Chip Resistors; Standard Pack Qty: 5000; RoHS - Mouser: E; Minimum Order Quantity: 1; Reeling: True; ComponentLink1URL: http://www.mouser.com/ds/2/427/dcrcwe3-109170.pdf; ComponentLink1Description: http://www.mouser.com/ds/2/427/dcrcwe3-109170.pdf; Supplier Part Number 1: 71-CRCW0805-31.6K-E3
R46 = 100K,0805: TE CONNECTIVITY / NEOHM - CPF0805B100KE1 - RESISTOR, 0805, 100K; Product Range: TE CONNECTIVITY - CPF Series; Resistance: 100; Resistance Tolerance: ± 0.1%; Resistor Case Style: 0805 [2012 Metric]; Resistor Element Material: Thin Film; Temperature Coefficient: ± 25; Voltage Rating: 200; External Depth: 0.5; External Length / Height: 2; External Width: 1.25; Resistor Mounting: SMD; Tolerance: ±5%; Power (Watts): 0.125W, 1/8W; Manufacturer: TE CONNECTIVITY / NEOHM; Manufacturer Part Number: CPF0805B100KE1; RoHS: YES; Power Rating: 100; Packaging: Cut Tape; MSL: -; No. of Pins: 2; Operating Temperature Max: 155; Operating Temperature Min: -55; Operating Temperature Range: -55°C to +155; Series: CPF<!--FANDB--><div class="features-and-benefits-container"></div>; ComponentLink1URL: http://www.tycoelectronics.com/commerce/DocumentDelivery/DDEController?Action=srchrtrv&DocNm=1614883&DocType=Customer+Drawing&DocLang=English; ComponentLink1Description: http://www.tycoelectronics.com/commerce/DocumentDelivery/DDEController?Action=srchrtrv&DocNm=1614883&DocType=Customer+Drawing&DocLang=English; ComponentLink2URL: http://www.tycoelectronics.com/commerce/DocumentDelivery/DDEController?Action=srchrtrv&DocNm=1773200&DocType=Data+Sheet&DocLang=English; ComponentLink2Description: http://www.tycoelectronics.com/commerce/DocumentDelivery/DDEController?Action=srchrtrv&DocNm=1773200&DocType=Data+Sheet&DocLang=English; Supplier 1: Digi-Key; Category: Resistors; Stock 1: 923150; Pricing 1: 1=0.1, 50=0.0196, 100=0.0149, 250=0.01104, 500=0.00816, 1000=0.00544, 2500=0.00459 (USD); Resistance (Ohms): 100k; Composition: Thick Film; Features: Automotive AEC-Q200; Operating Temperature: -55°C ~ 155°C; Package / Case: 0805 (2012 Metric); Supplier Device Package: 0805; Size / Dimension: 0.079" L x 0.049" W (2.00mm x 1.25mm); Height: 0.028" (0.70mm); Number of Terminations: 2; ComponentLink3URL: http://industrial.panasonic.com/www-cgi/jvcr13pz.cgi?E+PZ+3+AOA0001+ERJ6GEYJ104V+7+WW; ComponentLink3Description: http://industrial.panasonic.com/www-cgi/jvcr13pz.cgi?E+PZ+3+AOA0001+ERJ6GEYJ104V+7+WW; Supplier Part Number 1: P100KACT-ND
R48 = 499K,0805: Thick Film Resistors - SMD 1/8watt 499Kohms 1%; Manufacturer: Vishay / Dale; Manufacturer Part Number: CRCW0805499KFKEA; Power Rating: 125 mW (1/8 W); Temperature Coefficient: 100 PPM / K; Voltage Rating: 150 V; Case Height: 0.45 mm; Case Length: 2 mm; Case Width: 1.25 mm; Supplier 1: Mouser; RoHS: RoHS Compliant By Exemption; Category: Thick Film Resistors - SMD; Stock 1: 33034; Pricing 1: 1=0.119, 10=0.071, 100=0.040, 1000=0.027, 5000=0.007, 100000=0.006 (AUD); Operating Temperature Range: - 55 C to + 155 C; Package / Case: 0805 (2012 metric); Packaging: Reel; Product: Thick Film Resistors SMD; Resistance: 499 kOhms; Series: CRCW; Tolerance: 1 %; Brand: Vishay / Dale; Case Code - in: 0805; Case Code - mm: 2012; Product Category: 0805 Thick Film Chip Resistors; Standard Pack Qty: 5000; RoHS - Mouser: E; Minimum Order Quantity: 1; Reeling: True; ComponentLink1URL: http://www.mouser.com/ds/2/427/dcrcwe3-109170.pdf; ComponentLink1Description: http://www.mouser.com/ds/2/427/dcrcwe3-109170.pdf; Supplier Part Number 1: 71-CRCW0805-499K-E3
R51 = 1M,0805: MULTICOMP - MC0805S8F1004T5E - RESISTOR, THICK FILM, 1MOHM, 125mW, 1%; Product Range: MULTICOMP - MC Series; Resistance: 1; Power Rating: 125; Resistor Case Style: 0805 ^2012 Metric]; Power (Watts): 0.125W, 1/8W; Temperature Coefficient: ±100ppm/°C; Manufacturer: MULTICOMP; Manufacturer Part Number: MC0805S8F1004T5E; RoHS: Y-EX; Resistance Tolerance: ± 1%; Resistor Element Type: Thick Film; MSL: -; ComponentLink1URL: http://www.newark.com/pdfs/datasheets/spc/TA-677.pdf; ComponentLink1Description: http://www.newark.com/pdfs/datasheets/spc/TA-677.pdf; Supplier 1: Digi-Key; Category: Resistors; Stock 1: 548421; Pricing 1: 1=0.1, 50=0.0288, 100=0.0219, 250=0.01624, 500=0.012, 1000=0.008, 2500=0.00675 (USD); Packaging: Cut Tape (CT); Resistance (Ohms): 1M; Tolerance: ±1%; Composition: Thick Film; Features: Automotive AEC-Q200; Operating Temperature: -55°C ~ 155°C; Package / Case: 0805 (2012 Metric); Supplier Device Package: 0805; Size / Dimension: 0.079" L x 0.049" W (2.00mm x 1.25mm); Height: 0.028" (0.70mm); Number of Terminations: 2; ComponentLink2URL: http://industrial.panasonic.com/www-cgi/jvcr13pz.cgi?E+PZ+3+AOA0002+ERJ6ENF1004V+7+WW; ComponentLink2Description: http://industrial.panasonic.com/www-cgi/jvcr13pz.cgi?E+PZ+3+AOA0002+ERJ6ENF1004V+7+WW; Supplier Part Number 1: P1.00MCCT-ND
U5 = TPS65218: Mfr: TI; MfrNum: TPS65218xxx; TIIntPartnumber: 1A0359; DescriptiveText: Power Management IC for AM437x SOC Mult Outputs; Vendor: Digikey; Cost100: 0.xx; Cost10K: 0.xxx; PartName: TPS65218
U6 = TPS78101DDCT: LDO Voltage Regulators Sgl Output LDO 150mA Adj.; Manufacturer: Texas Instruments; Input Voltage MAX: 5.5 V; Number of Outputs: 1 Output; Output Type: Adjustable; Output Voltage: 1.22 V to 5.25 V; Dropout Voltage - Max: 250 mV; Voltage Regulation Accuracy: 2 %; Development Kit: TPS78101EVM-339; Input Voltage MIN: + 2.2 V; Line Regulation: 1 %; Maximum Power Dissipation: 0.5 W; Reference Voltage: 1.216 V; Supplier 1: Mouser; Manufacturer Part Number: TPS78101DDCT; RoHS: RoHS Compliant; Category: LDO Voltage Regulators; Stock 1: 1082; Pricing 1: 1=1.63, 10=1.45, 25=1.30, 50=1.21, 100=1.14, 250=0.974, 500=0.861, 750=0.751, 1000=0.566 (AUD); Output Current: 150 mA; Package / Case: SOT-23-5; Packaging: Reel; Series: TPS78101; Brand: Texas Instruments; Mounting Style: SMD/SMT; Load Regulation: 2 %; Maximum Operating Temperature: + 125 C; Minimum Operating Temperature: - 40 C; Product Category: Regulators - Low Dropout (LDO); Standard Pack Qty: 250; RoHS - Mouser: Y; Minimum Order Quantity: 1; Reeling: True; ComponentLink1URL: http://www.mouser.com/ds/2/405/sbvs102b-203770.pdf; ComponentLink1Description: http://www.mouser.com/ds/2/405/sbvs102b-203770.pdf; Supplier Part Number 1: 595-TPS78101DDCT